# EasyEDA Pro project 数字电子钟（原理图与PCB）.eprj

# Schematic Schematic1
Board Name: Board1; Create Date: 2026-03-15; Page Name: P1; Project Name: 数字电子钟（原理图与PCB）; Schematic Name: Schematic1; Update Date: 2026-03-15; Company: 嘉立创EDA; Page Size: A4; Version: V1.0
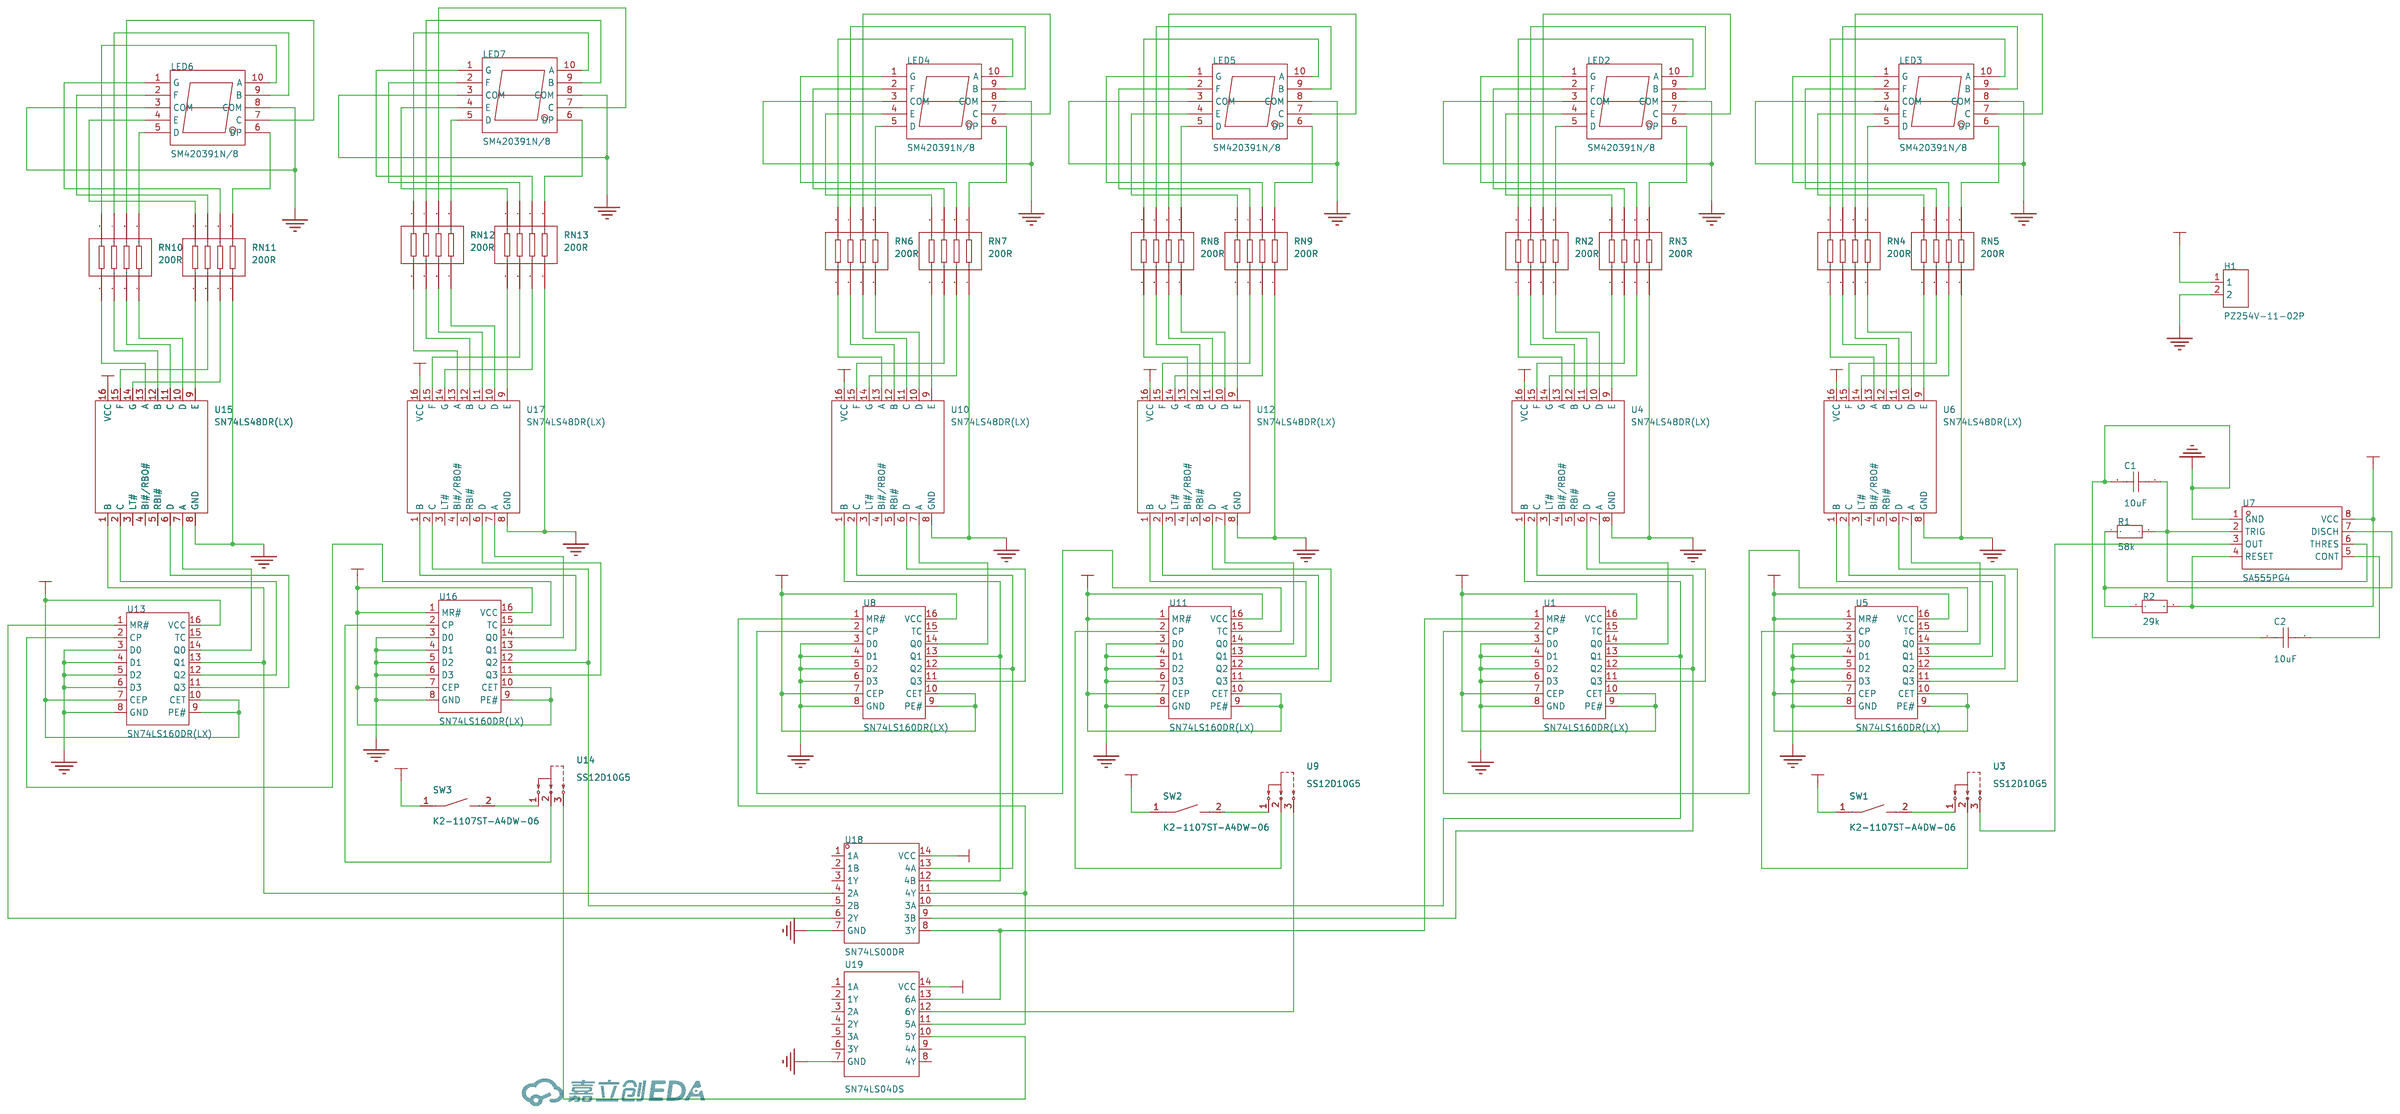
[diagram p0: schematic sheet]

## Parts
C1  10uF  [C0603]
C2  10uF  [C0603]
H1  PZ254V-11-02P  [HDR-TH_2P-P2.54-V-M]
LED2  SM420391N/8  [LED-SEG-TH_10P-L10.0-W13.0-P2.54-S7.62-TL]
LED3  SM420391N/8  [LED-SEG-TH_10P-L10.0-W13.0-P2.54-S7.62-TL]
LED4  SM420391N/8  [LED-SEG-TH_10P-L10.0-W13.0-P2.54-S7.62-TL]
LED5  SM420391N/8  [LED-SEG-TH_10P-L10.0-W13.0-P2.54-S7.62-TL]
LED6  SM420391N/8  [LED-SEG-TH_10P-L10.0-W13.0-P2.54-S7.62-TL]
LED7  SM420391N/8  [LED-SEG-TH_10P-L10.0-W13.0-P2.54-S7.62-TL]
R1  58k  [R2512]
R2  29k  [R2512]
RN2  200R  [RES-ARRAY-SMD_0603-8P-L3.2-W1.6-BL]
RN3  200R  [RES-ARRAY-SMD_0603-8P-L3.2-W1.6-BL]
RN4  200R  [RES-ARRAY-SMD_0603-8P-L3.2-W1.6-BL]
RN5  200R  [RES-ARRAY-SMD_0603-8P-L3.2-W1.6-BL]
RN6  200R  [RES-ARRAY-SMD_0603-8P-L3.2-W1.6-BL]
RN7  200R  [RES-ARRAY-SMD_0603-8P-L3.2-W1.6-BL]
RN8  200R  [RES-ARRAY-SMD_0603-8P-L3.2-W1.6-BL]
RN9  200R  [RES-ARRAY-SMD_0603-8P-L3.2-W1.6-BL]
RN10  200R  [RES-ARRAY-SMD_0603-8P-L3.2-W1.6-BL]
RN11  200R  [RES-ARRAY-SMD_0603-8P-L3.2-W1.6-BL]
RN12  200R  [RES-ARRAY-SMD_0603-8P-L3.2-W1.6-BL]
RN13  200R  [RES-ARRAY-SMD_0603-8P-L3.2-W1.6-BL]
SW1  K2-1107ST-A4DW-06  [KEY-SMD_L6.2-W3.6-LS8.0_K2-1107ST-A4SW-06]
SW2  K2-1107ST-A4DW-06  [KEY-SMD_L6.2-W3.6-LS8.0_K2-1107ST-A4SW-06]
SW3  K2-1107ST-A4DW-06  [KEY-SMD_L6.2-W3.6-LS8.0_K2-1107ST-A4SW-06]
U1  SN74LS160DR(LX)  [SOP-16_L9.9-W3.9-P1.27-LS6.0-BL]
U3  SS12D10G5  [SW-TH_SHOU-HAN_SS12D10G4]
U4  SN74LS48DR(LX)  [SOIC-16_L9.9-W3.8-P1.27-LS6.0-BL]
U5  SN74LS160DR(LX)  [SOP-16_L9.9-W3.9-P1.27-LS6.0-BL]
U6  SN74LS48DR(LX)  [SOIC-16_L9.9-W3.8-P1.27-LS6.0-BL]
U7  SA555PG4  [PDIP-8_L9.6-W6.4-P2.54-LS7.6-BL]
U8  SN74LS160DR(LX)  [SOP-16_L9.9-W3.9-P1.27-LS6.0-BL]
U9  SS12D10G5  [SW-TH_SHOU-HAN_SS12D10G4]
U10  SN74LS48DR(LX)  [SOIC-16_L9.9-W3.8-P1.27-LS6.0-BL]
U11  SN74LS160DR(LX)  [SOP-16_L9.9-W3.9-P1.27-LS6.0-BL]
U12  SN74LS48DR(LX)  [SOIC-16_L9.9-W3.8-P1.27-LS6.0-BL]
U13  SN74LS160DR(LX)  [SOP-16_L9.9-W3.9-P1.27-LS6.0-BL]
U14  SS12D10G5  [SW-TH_SHOU-HAN_SS12D10G4]
U15  SN74LS48DR(LX)  [SOIC-16_L9.9-W3.8-P1.27-LS6.0-BL]
U16  SN74LS160DR(LX)  [SOP-16_L9.9-W3.9-P1.27-LS6.0-BL]
U17  SN74LS48DR(LX)  [SOIC-16_L9.9-W3.8-P1.27-LS6.0-BL]
U18  SN74LS00DR  [SOIC-14_L8.7-W3.9-P1.27-LS6.0-BL]
U19  SN74LS04DS  [SOP-14_L8.6-W3.9-P1.27-LS6.0-BL]

## Library data of the parts
C1 C2 = CGA0603X7R104K500JT: LCSC Part Name: 100nF ±10% 50V; Supplier Part: C6119867; Manufacturer: HRE(芯声); Supplier Footprint: 0603; JLCPCB Part Class: 扩展库; Datasheet: https://item.szlcsc.com/datasheet/CGA0603X7R104K500JT/7062573.html; Supplier: LCSC; Tolerance: ±10%; Voltage Rating: 50V; Temperature Coefficient: X7R
H1 = PZ254V-11-02P: LCSC Part Name: 1x2P 间距:2.54mm 方针 直插; Supplier Part: C492401; Manufacturer: XFCN(兴飞); Supplier Footprint: 插件,P=2.54mm; JLCPCB Part Class: 扩展库; Datasheet: https://item.szlcsc.com/datasheet/PZ254V-11-02P/502957.html; Supplier: LCSC; Pin Structure: 1x2P; Pitch: 2.54mm; Circluar Pins/Square Pins: 方针; Mounting Type: 直插; Number of Rows: 单排; Number of Pins: 2P; Current Rating: 3A; Voltage Rating (Max): 250V; Length of Mating Pin: 6mm; Insulation Height: 2.5mm; Length of End Connection Pin: 3mm; Contact Material: 黄铜; Operating Temperature: -40℃~+105℃; Color: 黑色
LED2-LED7 = SM420391N/8: LCSC Part Name: 1位0.39英寸红色数码管 共阴极; Supplier Part: C252199; Manufacturer: ARKLED(方舟); Supplier Footprint: 插件; JLCPCB Part Class: 扩展库; Datasheet: https://item.szlcsc.com/datasheet/SM420391N%252F8/247672.html; Supplier: LCSC; Number of Characters: 1位; Digit/Alpha Size(inch): 0.39; Illumination Color: 红色; LED Polarity: 共阴极
R1 R2 = JER2512F3R005: LCSC Part Name: 5mΩ 3W 2512 ±1%; Supplier Part: C46634460; Manufacturer: JIERR(捷而瑞); Supplier Footprint: 2512; JLCPCB Part Class: 扩展库; Datasheet: https://item.szlcsc.com/datasheet/JER2512F3R005/48788262.html; Supplier: LCSC; Type: 采样电阻；合金电阻; Tolerance: ±1%; Power(Watts): 3W; Temperature Coefficient: ±50ppm/℃
RN2-RN13 = 4D03WGJ0103T5E: LCSC Part Name: 10kΩ ±5%; Supplier Part: C29718; Manufacturer: UNI-ROYAL(厚声); Supplier Footprint: 0603x4; JLCPCB Part Class: 基础库; Datasheet: https://atta.szlcsc.com/upload/public/pdf/source/20191224/C474318_2527498AE30E813171187CCD28401A71.pdf; Supplier: LCSC; Number of Resistors: 4; Tolerance: ±5%; Power(Watts): 62.5mW; Temperature Coefficient: ±200ppm/℃; Number of Pins: 8
SW1-SW3 = K2-1107ST-A4DW-06: LCSC Part Name: 轻触开关 3.6*6.1*2.5; Supplier Part: C118141; Manufacturer: 韩国韩荣; Supplier Footprint: SMD,6.1x3.6mm; JLCPCB Part Class: 扩展库; Datasheet: https://item.szlcsc.com/datasheet/K2-1107ST-A4DW-06/119400.html; Supplier: LCSC; Circuit: 单刀单掷; Actuator Style: 矩形按钮; Operating Force: 2.5N; Mounting Type: 立贴; Length: 6.1mm; Width: 3.6mm; Switch Height: 2.5mm; Contact Current: 50mA; Voltage Rating: 12V; Life: 10万次; Operating Temperature: -25℃~+85℃
U1 U5 U8 U11 U13 U16 = SN74LS160DR(LX): Supplier Part: C22449619; Manufacturer: LX(灵星芯微); Supplier Footprint: SOP-16; JLCPCB Part Class: Extended Part; Datasheet: https://item.szlcsc.com/datasheet/SN74LS160DR(LX)/24113596.html; Supplier: LCSC; Logic Type: 10分频; Direction: 向上计数器; Voltage - Supply: 2V~6V; Trigger Type: 上升沿; Reset: 异步; Timing: 同步; Count Rate: 35MHz; Operating Temperature: -40℃~+125℃; Number of Bits per Element: 4; Propagation Delay: 19ns
U3 U9 U14 = SS12D10G5: LCSC Part Name: SS12D10G5-7.0; Supplier Part: C7431054; Manufacturer: SHOU HAN(首韩); Supplier Footprint: 插件,12.7x6.7mm; JLCPCB Part Class: 扩展库; Datasheet: https://item.szlcsc.com/datasheet/SS12D10G5/8431406.html; Supplier: LCSC; Circuit: 单刀双掷; Length: 12.7mm; Width: 6.7mm; Mounting Type: 直插; Current Rating: 2A; Voltage Rating: 125V; Life: 3千次; Operating Temperature: -25℃~+70℃
U4 U6 U10 U12 U15 U17 = SN74LS48DR(LX): LCSC Part Name: SN74LS48DR; Supplier Part: C22466305; Manufacturer: LX(灵星芯微); Supplier Footprint: SOP-16; JLCPCB Part Class: Extended Part; Datasheet: https://item.szlcsc.com/datasheet/SN74LS48DR(LX)/24165315.html; Supplier: LCSC; Configuration: 7段x1位; Voltage - Supply: 2V~6V; Features: 共阴极; Operating Temperature: -40℃~+125℃; Pd - Power Dissipation: 500mW
U7 = SA555PG4: Supplier Part: C1539978; Manufacturer: TI(德州仪器); Supplier Footprint: PDIP-8; JLCPCB Part Class: 扩展库; Supplier: LCSC; Supply Voltage: 4.5V~16V; Supply Current: 10mA; Operating Temperature: -40℃~+85℃
U18 = SN74LS00DR: LCSC Part Name: 四路 2 输入正与非门; Supplier Part: C74558; Manufacturer: TI(德州仪器); Supplier Footprint: SOIC-14; JLCPCB Part Class: Extended Part; Datasheet: https://www.ti.com/cn/lit/gpn/sn74ls00; Supplier: LCSC; Logic Type: 与非门; Number of Channels: 4; Voltage - Supply: 4.75V~5.25V; Current - Output Low(IOL): 8mA; Current - Output High(IOH): 400uA; Input Logic Level - High: 2V; Input Logic Level - Low: 800mV; Output Logic Level - High: 2.5V; Output Logic Level - Low: 500mV; Series: 74LS系列; Propagation Delay: 15ns@5V,15pF; Operating Temperature: 0℃~+70℃; Input Number: 2
U19 = SN74LS04DS: Supplier Part: C52091994; Manufacturer: GMIC(绿微); Supplier Footprint: SOP-14; JLCPCB Part Class: Extended Part; Datasheet: https://item.szlcsc.com/datasheet/SN74LS04DS/54863988.html; Supplier: LCSC; Voltage - Supply: 2V~6V; Quiescent Current(Iq): 2uA; Number of Circuits: 6; Current - Output Low(IOL): 5.2mA; Current - Output High(IOH): 5.2mA; Input Logic Level - High: 1.5V~4.2V; Input Logic Level -Low: 500mV~1.8V; Output Logic Level - High: 1.9V~5.9V; Output Logic Level - Low: 100mV~260mV; Propagation Delay: 14ns@6V; Series: 74LS系列; Operating Temperature: -40℃~+125℃

## Nets
+5V: H1.1 R2.2 SW1.1 SW2.1 SW3.1 U1.7(CEP) U1.9(PE#) U1.10(CET) U1.16(VCC) U4.16(VCC) U5.1(MR#) U5.7(CEP) U5.9(PE#) U5.10(CET) U5.16(VCC) U6.16(VCC) U7.4(RESET) U7.8(VCC) U8.7(CEP) U8.9(PE#) U8.10(CET) U8.16(VCC) U10.16(VCC) U11.1(MR#) U11.7(CEP) U11.9(PE#) U11.10(CET) U11.16(VCC) U12.16(VCC) U13.7(CEP) U13.9(PE#) U13.10(CET) U13.16(VCC) U15.16(VCC) U16.1(MR#) U16.7(CEP) U16.9(PE#) U16.10(CET) U16.16(VCC) U17.16(VCC) U18.14(VCC) U19.14(VCC)
GND: C1.2 C2.1 H1.2 LED2.3(COM) LED2.8(COM) LED3.3(COM) LED3.8(COM) LED4.3(COM) LED4.8(COM) LED5.3(COM) LED5.8(COM) LED6.3(COM) LED6.8(COM) LED7.3(COM) LED7.8(COM) RN3.4 RN5.4 RN7.4 RN9.4 RN11.4 RN13.4 U1.3(D0) U1.4(D1) U1.5(D2) U1.6(D3) U1.8(GND) U4.8(GND) U5.3(D0) U5.4(D1) U5.5(D2) U5.6(D3) U5.8(GND) U6.8(GND) U7.1(GND) U8.3(D0) U8.4(D1) U8.5(D2) U8.6(D3) U8.8(GND) U10.8(GND) U11.3(D0) U11.4(D1) U11.5(D2) U11.6(D3) U11.8(GND) U12.8(GND) U13.3(D0) U13.4(D1) U13.5(D2) U13.6(D3) U13.8(GND) U15.8(GND) U16.3(D0) U16.4(D1) U16.5(D2) U16.6(D3) U16.8(GND) U17.8(GND) U18.7(GND) U19.7(GND)
$1N958: U1.13(Q1) U4.1(B) U18.10(3A)
$1N987: U1.14(Q0) U4.7(A)
$1N1052: U1.12(Q2) U4.2(C) U18.9(3B)
$1N1059: U1.11(Q3) U4.6(D)
$1N1738: RN2.1 U4.13(A)
$1N1744: RN2.2 U4.12(B)
$1N1751: RN2.3 U4.11(C)
$1N1758: RN2.4 U4.10(D)
$1N1765: RN3.1 U4.9(E)
$1N1772: RN3.2 U4.15(F)
$1N1781: RN3.3 U4.14(G)
$1N2117: LED2.10(A) RN2.8
$1N2128: LED2.9(B) RN2.7
$1N2138: LED2.7(C) RN2.6
$1N2150: LED2.5(D) RN2.5
$1N2410: LED2.4(E) RN3.8
$1N2417: LED2.2(F) RN3.7
$1N2425: LED2.1(G) RN3.6
$1N2437: LED2.6(DP) RN3.5
$1N2889: U5.13(Q1) U6.1(B)
$1N2894: U5.14(Q0) U6.7(A)
$1N2912: U5.12(Q2) U6.2(C)
$1N2917: U5.11(Q3) U6.6(D)
$1N2922: RN4.1 U6.13(A)
$1N2926: RN4.2 U6.12(B)
$1N2930: RN4.3 U6.11(C)
$1N2934: RN4.4 U6.10(D)
$1N2938: RN5.1 U6.9(E)
$1N2940: RN5.2 U6.15(F)
$1N2944: RN5.3 U6.14(G)
$1N2950: LED3.10(A) RN4.8
$1N2955: LED3.5(D) RN4.5
$1N2958: LED3.7(C) RN4.6
$1N2963: LED3.9(B) RN4.7
$1N2968: LED3.4(E) RN5.8
$1N2973: LED3.2(F) RN5.7
$1N2978: LED3.1(G) RN5.6
$1N2983: LED3.6(DP) RN5.5
$1N3417: R1.1 R2.1 U7.7(DISCH)
$1N3437: C1.1 R1.2 U7.2(TRIG) U7.6(THRES)
$1N3494: C2.2 U7.5(CONT)
$1N3520: U3.3 U7.3(OUT)
$1N3527: U3.2 U5.2(CP)
$1N3641: SW1.2 U3.1
$1N3646: U1.2(CP) U5.15(TC)
$1N4551: U8.13(Q1) U10.1(B) U18.12(4B)
$1N4556: U8.14(Q0) U10.7(A)
$1N4574: U8.12(Q2) U10.2(C) U18.13(4A)
$1N4579: U8.11(Q3) U10.6(D)
$1N4584: RN6.1 U10.13(A)
$1N4588: RN6.2 U10.12(B)
$1N4592: RN6.3 U10.11(C)
$1N4596: RN6.4 U10.10(D)
$1N4600: RN7.1 U10.9(E)
$1N4602: RN7.2 U10.15(F)
$1N4606: RN7.3 U10.14(G)
$1N4612: LED4.10(A) RN6.8
$1N4617: LED4.5(D) RN6.5
$1N4620: LED4.7(C) RN6.6
$1N4625: LED4.9(B) RN6.7
$1N4630: LED4.4(E) RN7.8
$1N4635: LED4.2(F) RN7.7
$1N4640: LED4.1(G) RN7.6
$1N4645: LED4.6(DP) RN7.5
$1N4671: U11.13(Q1) U12.1(B)
$1N4676: U11.14(Q0) U12.7(A)
$1N4694: U11.12(Q2) U12.2(C)
$1N4699: U11.11(Q3) U12.6(D)
$1N4704: RN8.1 U12.13(A)
$1N4708: RN8.2 U12.12(B)
$1N4712: RN8.3 U12.11(C)
$1N4716: RN8.4 U12.10(D)
$1N4720: RN9.1 U12.9(E)
$1N4722: RN9.2 U12.15(F)
$1N4726: RN9.3 U12.14(G)
$1N4732: LED5.10(A) RN8.8
$1N4737: LED5.5(D) RN8.5
$1N4740: LED5.7(C) RN8.6
$1N4745: LED5.9(B) RN8.7
$1N4750: LED5.4(E) RN9.8
$1N4755: LED5.2(F) RN9.7
$1N4760: LED5.1(G) RN9.6
$1N4765: LED5.6(DP) RN9.5
$1N4784: U9.2 U11.2(CP)
$1N4792: SW2.2 U9.1
$1N4794: U8.2(CP) U11.15(TC)
$1N5692: U13.14(Q0) U15.7(A)
$1N5710: U13.12(Q2) U15.2(C)
$1N5715: U13.11(Q3) U15.6(D)
$1N5720: RN10.1 U15.13(A)
$1N5724: RN10.2 U15.12(B)
$1N5728: RN10.3 U15.11(C)
$1N5732: RN10.4 U15.10(D)
$1N5736: RN11.1 U15.9(E)
$1N5738: RN11.2 U15.15(F)
$1N5742: RN11.3 U15.14(G)
$1N5748: LED6.10(A) RN10.8
$1N5753: LED6.5(D) RN10.5
$1N5756: LED6.7(C) RN10.6
$1N5761: LED6.9(B) RN10.7
$1N5766: LED6.4(E) RN11.8
$1N5771: LED6.2(F) RN11.7
$1N5776: LED6.1(G) RN11.6
$1N5781: LED6.6(DP) RN11.5
$1N5807: U16.13(Q1) U17.1(B)
$1N5812: U16.14(Q0) U17.7(A)
$1N5830: U16.12(Q2) U17.2(C) U18.5(2B)
$1N5835: U16.11(Q3) U17.6(D)
$1N5840: RN12.1 U17.13(A)
$1N5844: RN12.2 U17.12(B)
$1N5848: RN12.3 U17.11(C)
$1N5852: RN12.4 U17.10(D)
$1N5856: RN13.1 U17.9(E)
$1N5858: RN13.2 U17.15(F)
$1N5862: RN13.3 U17.14(G)
$1N5868: LED7.10(A) RN12.8
$1N5873: LED7.5(D) RN12.5
$1N5876: LED7.7(C) RN12.6
$1N5881: LED7.9(B) RN12.7
$1N5886: LED7.4(E) RN13.8
$1N5891: LED7.2(F) RN13.7
$1N5896: LED7.1(G) RN13.6
$1N5901: LED7.6(DP) RN13.5
$1N5916: U14.2 U16.2(CP)
$1N5924: SW3.2 U14.1
$1N5926: U13.2(CP) U16.15(TC)
$1N6192: U8.1(MR#) U18.11(4Y) U19.11(5A)
$1N6278: U1.1(MR#) U18.8(3Y) U19.13(6A)
$1N6512: U9.3 U19.12(6Y)
$1N6532: U14.3 U19.10(5Y)
$1N6571: U13.1(MR#) U18.6(2Y)
$1N6582: U13.13(Q1) U15.1(B) U18.4(2A)

Not connected (* = marked no-connect by the designer): U1 15(TC); U4 3(LT#) 4(BI#/RBO#) 5(RBI#); U6 3(LT#) 4(BI#/RBO#) 5(RBI#); U8 15(TC); U10 3(LT#) 4(BI#/RBO#) 5(RBI#); U12 3(LT#) 4(BI#/RBO#) 5(RBI#); U13 15(TC); U15 3(LT#) 4(BI#/RBO#) 5(RBI#); U17 3(LT#) 4(BI#/RBO#) 5(RBI#); U18 1(1A) 2(1B) 3(1Y); U19 1(1A) 2(1Y) 3(2A) 4(2Y) 5(3A) 6(3Y) 8(4Y) 9(4A)

# Board PCB1
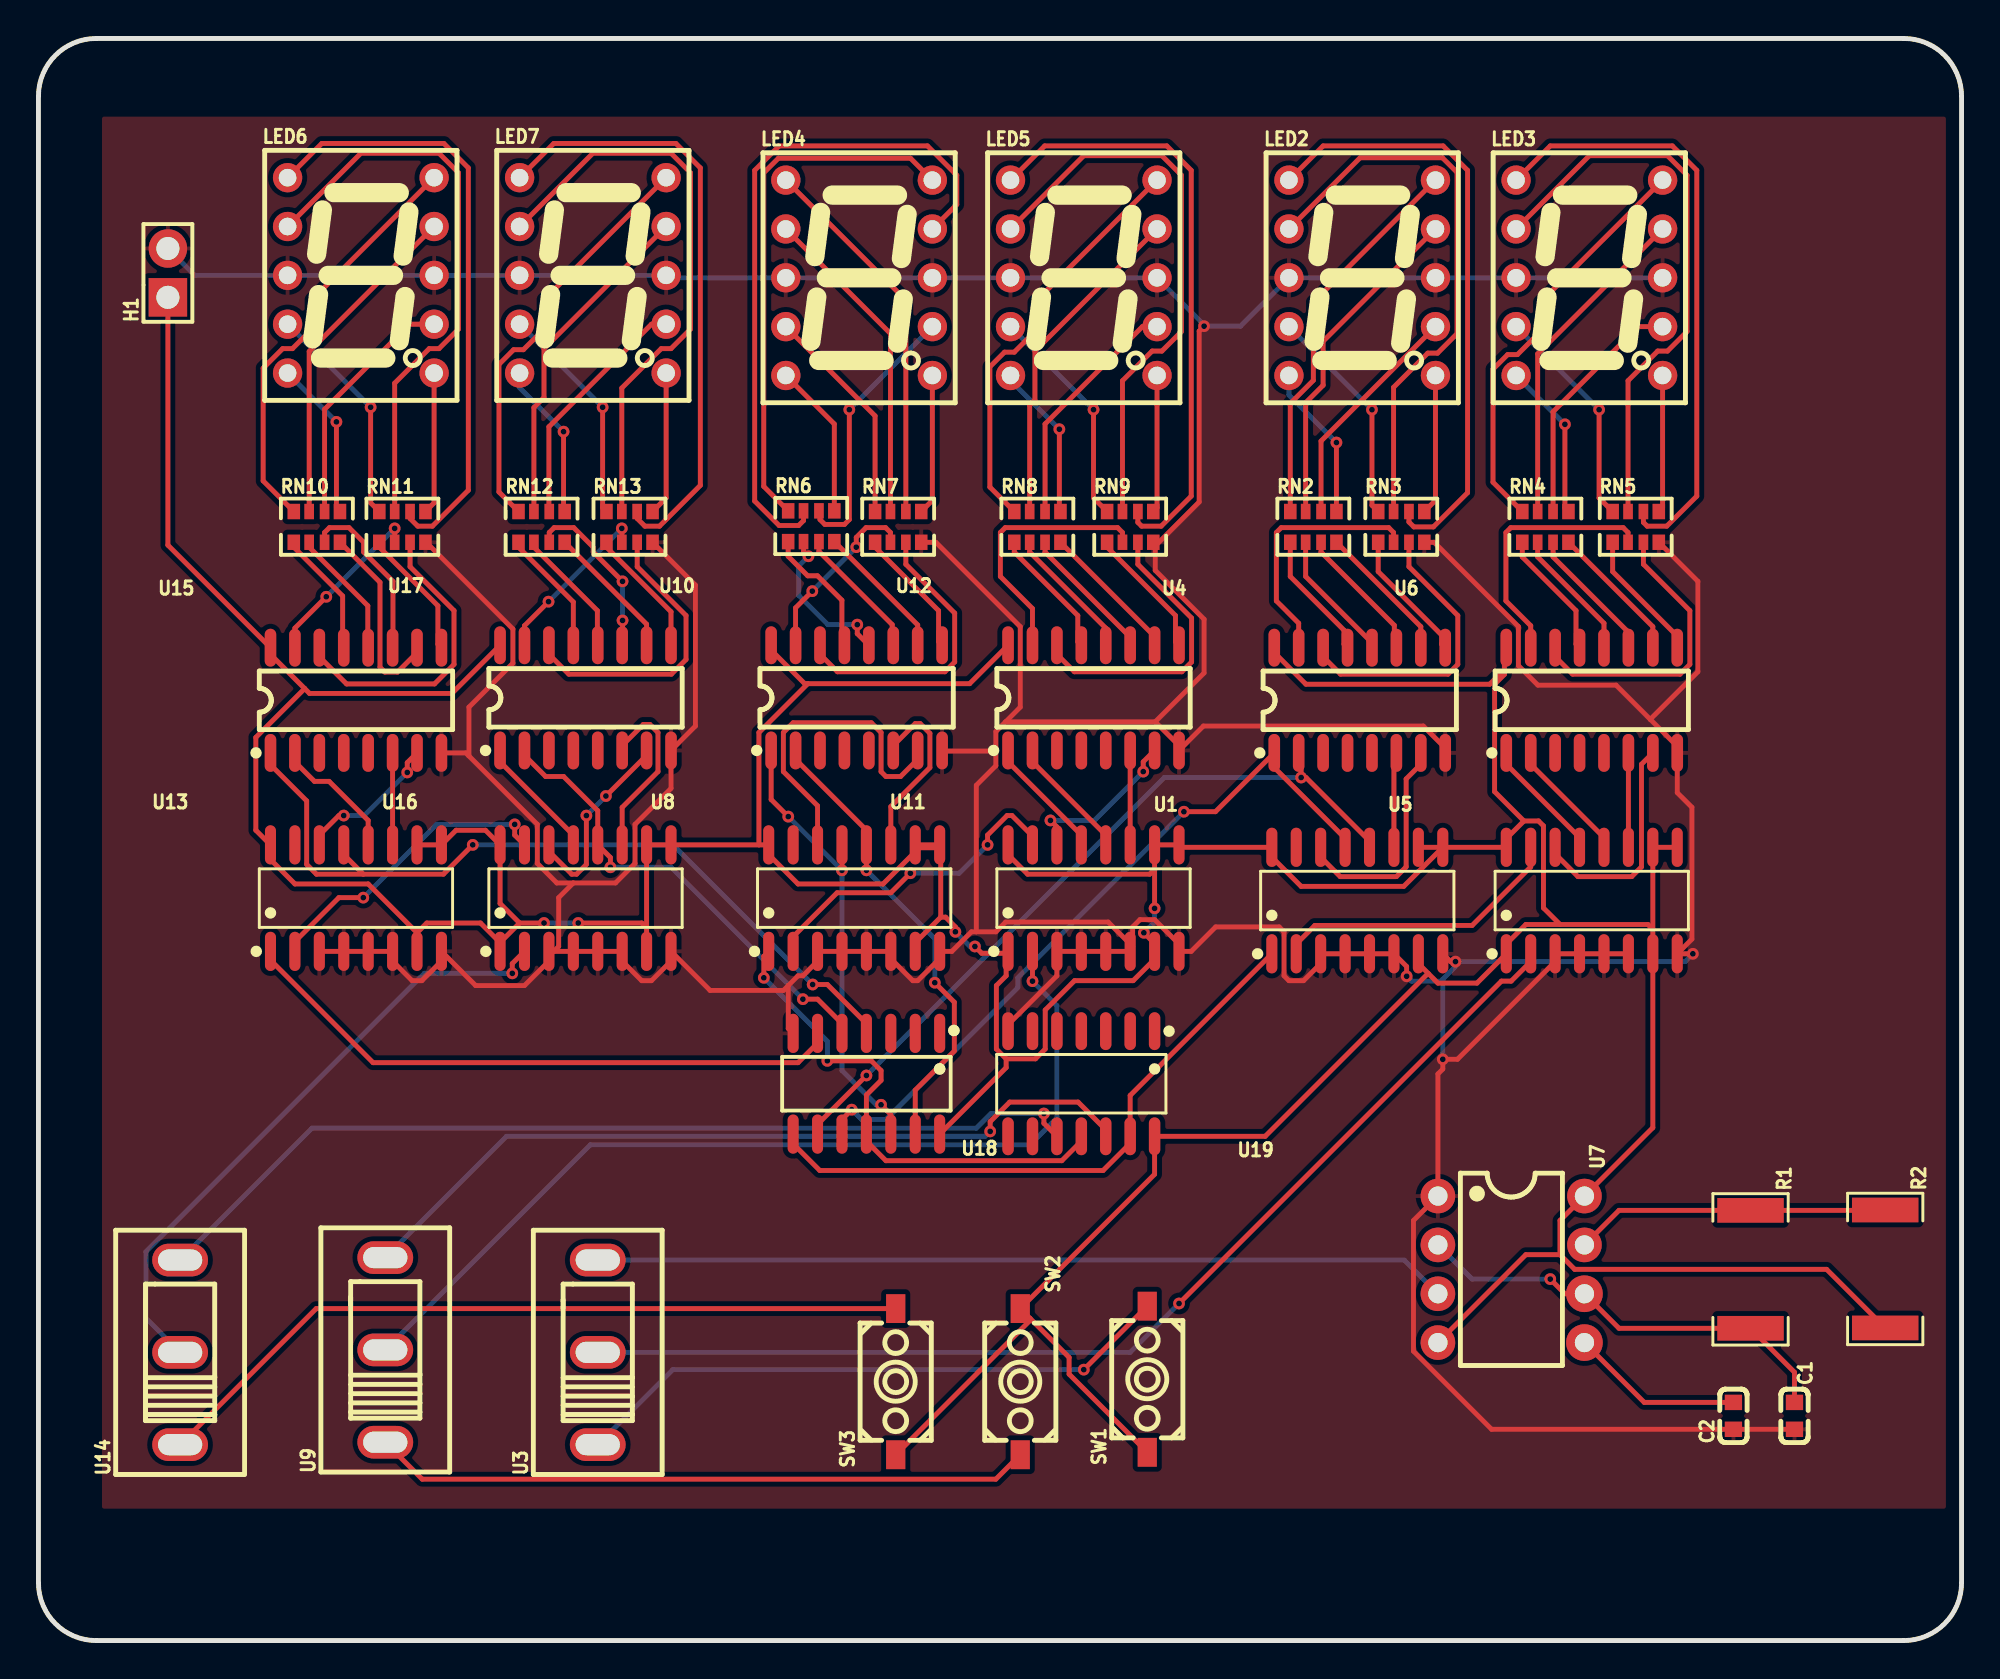
[diagram p1: board, top side]
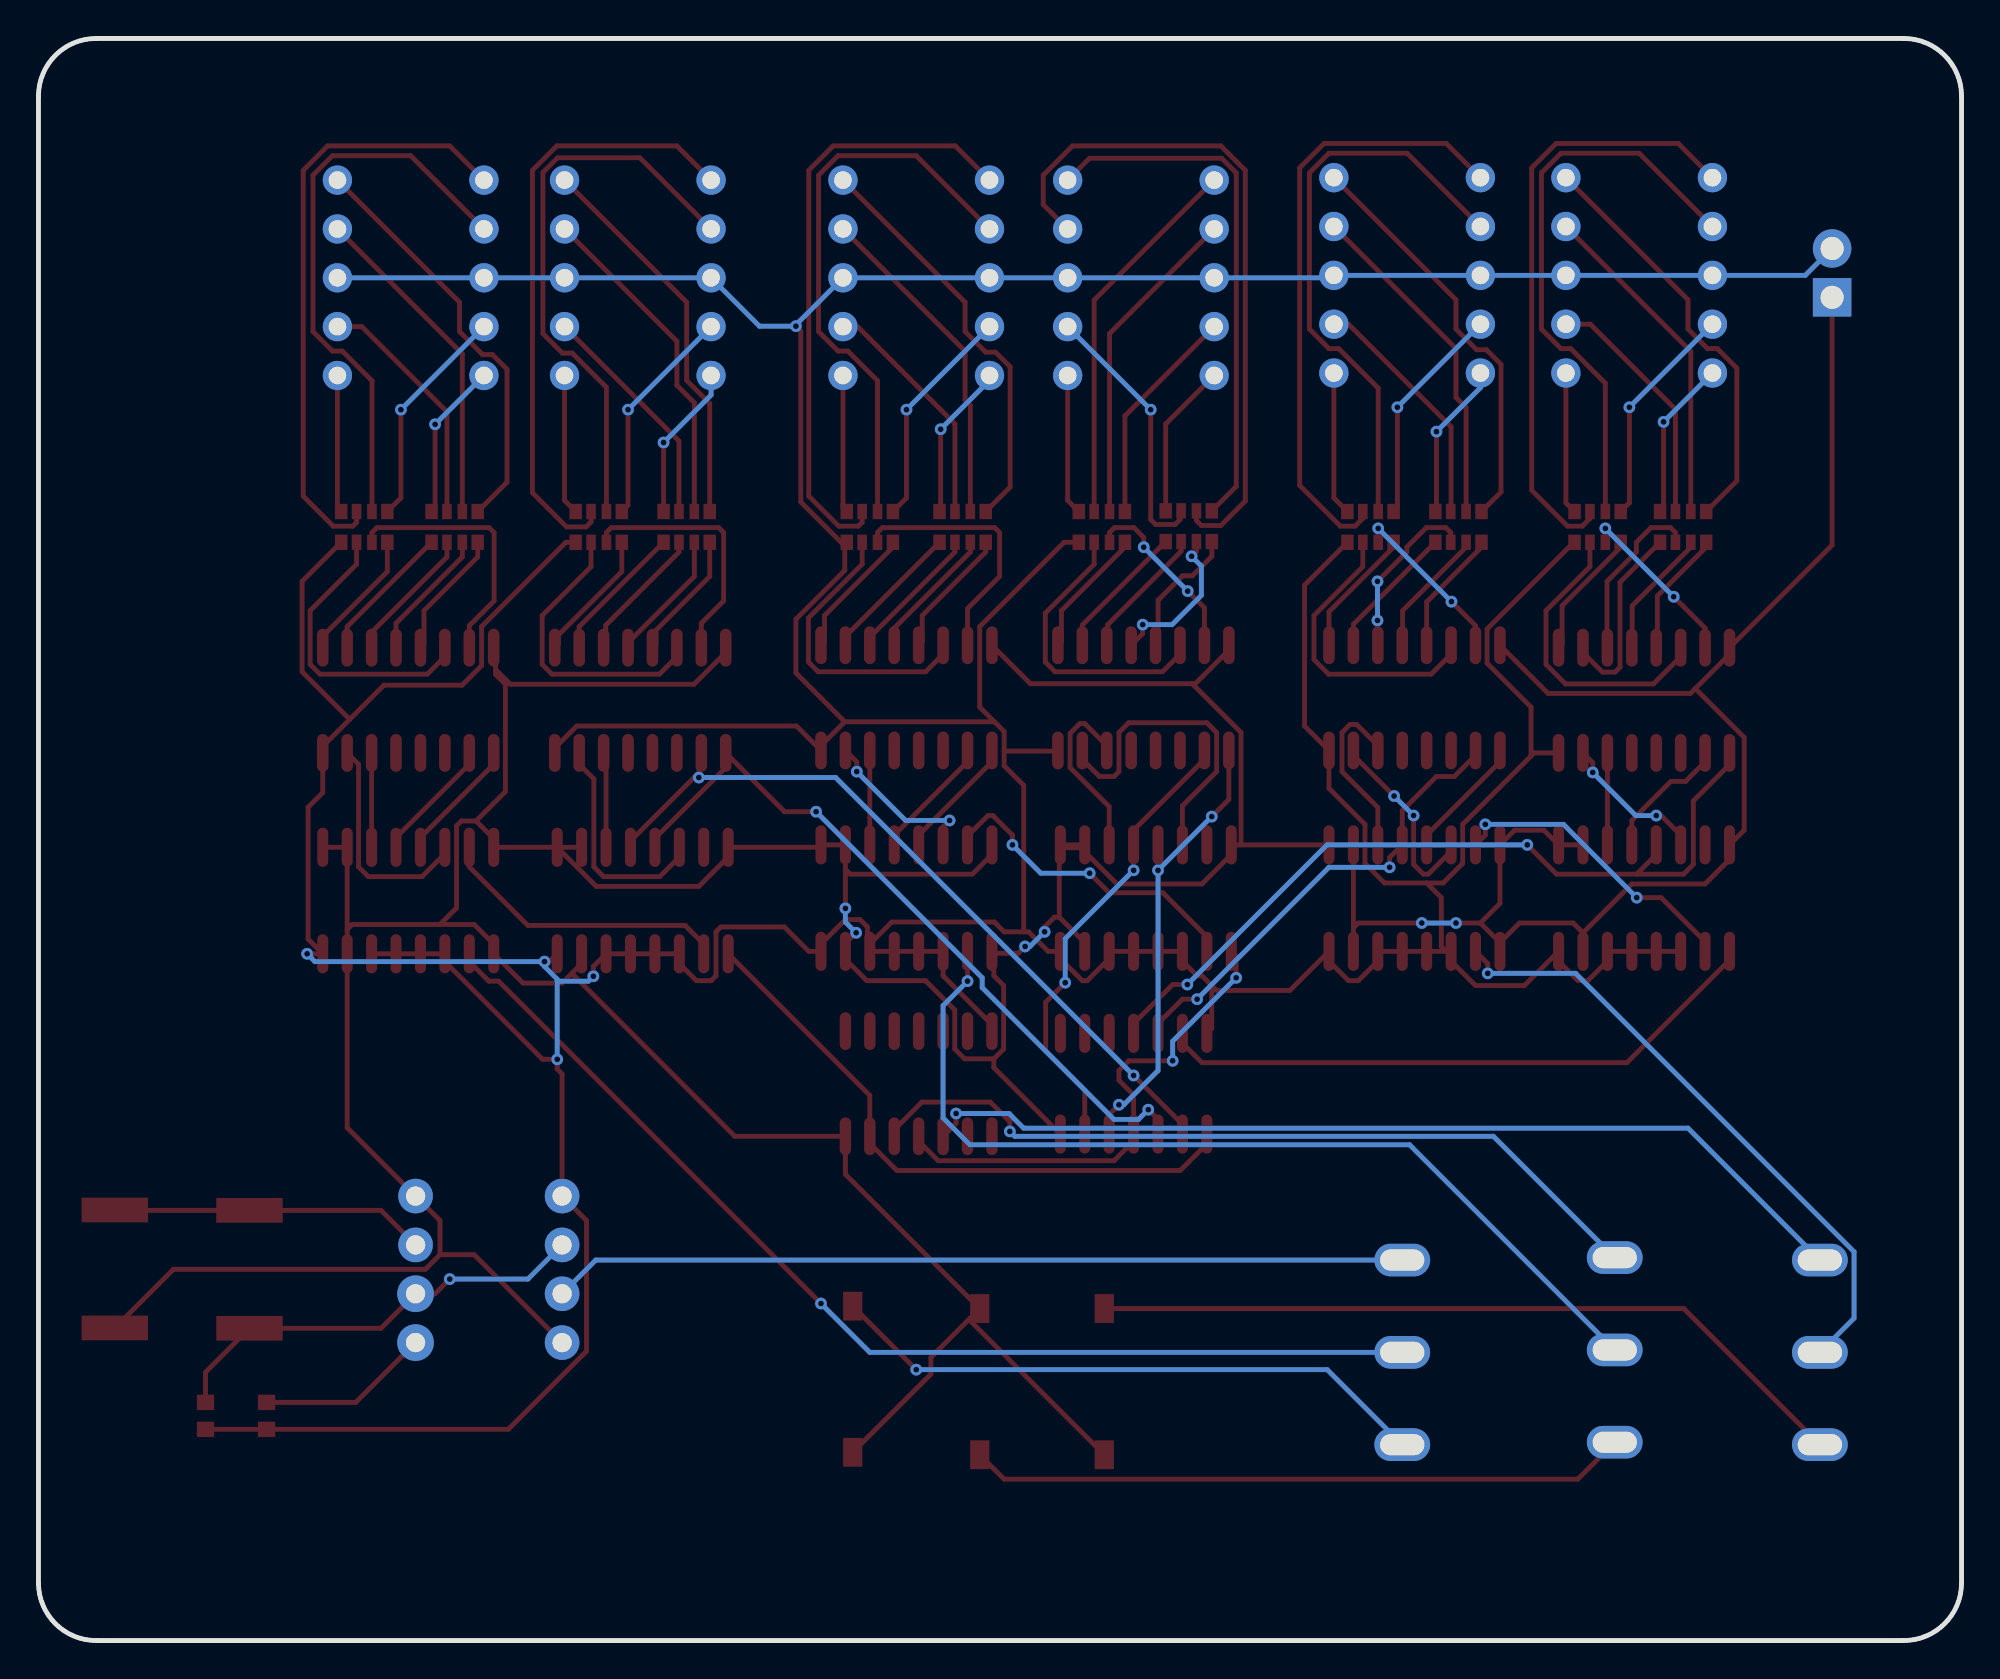
[diagram p2: board, bottom side, seen from below]

Outline 100 x 83.31 mm; copper layers: Top Layer, Bottom Layer. Coordinates in mm from the lower left corner of the outline.
Outline path: 0,80.31 0,3 arc(0.88,0.88) 3,0 97,0 arc(99.12,0.88) 100,3 100,80.31 arc(99.12,82.43) 97,83.31 3,83.31 arc(0.88,82.43) 0,80.31
Stack: Top Layer 0.035mm / Dielectric1 1.51mm FR4 er 4.5 / Bottom Layer 0.035mm

## Design rules (mm)
template: JLCPCB Capability(Two Layers Board)
spacing copperThickness1oz (default): track to track 0.102, other pairs 0.152 to 0.3
spacing copperThickness2oz: track to track 0.203, other pairs 0.152 to 0.3
track width copperThickness1oz (default): min 0.127, default 0.254, max 2.54
track width copperThickness2oz: min 0.203, default 0.254, max 2.54
differential pair differentialPair (default): width min 0.127, default 0.254, max 2.54; gap min 0.152, default 0.152
via viaSize (default): diameter min 0.5, default 0.61, max 10; hole min 0.3, default 0.305, max 6.3

## Placement (name value [footprint] x y rotation side)
C1  10uF  [C0603]  91.31 11.68 270 top
C2  10uF  [C0603]  88.14 11.68 90 top
H1  PZ254V-11-02P  [HDR-TH_2P-P2.54-V-M]  6.73 71.12 90 top
LED2  SM420391N/8  [LED-SEG-TH_10P-L10.0-W13.0-P2.54-S7.62-TL]  68.83 70.87 0 top
LED3  SM420391N/8  [LED-SEG-TH_10P-L10.0-W13.0-P2.54-S7.62-TL]  80.65 70.87 0 top
LED4  SM420391N/8  [LED-SEG-TH_10P-L10.0-W13.0-P2.54-S7.62-TL]  42.67 70.87 0 top
LED5  SM420391N/8  [LED-SEG-TH_10P-L10.0-W13.0-P2.54-S7.62-TL]  54.36 70.87 0 top
LED6  SM420391N/8  [LED-SEG-TH_10P-L10.0-W13.0-P2.54-S7.62-TL]  16.76 70.99 0 top
LED7  SM420391N/8  [LED-SEG-TH_10P-L10.0-W13.0-P2.54-S7.62-TL]  28.83 70.99 0 top
R1  58k  [R2512]  89.03 19.3 270 top
R2  29k  [R2512]  96.03 19.32 270 top
RN2  200R  [RES-ARRAY-SMD_0603-8P-L3.2-W1.6-BL]  66.29 57.91 0 top
RN3  200R  [RES-ARRAY-SMD_0603-8P-L3.2-W1.6-BL]  70.87 57.91 0 top
RN4  200R  [RES-ARRAY-SMD_0603-8P-L3.2-W1.6-BL]  78.36 57.91 0 top
RN5  200R  [RES-ARRAY-SMD_0603-8P-L3.2-W1.6-BL]  83.06 57.91 0 top
RN6  200R  [RES-ARRAY-SMD_0603-8P-L3.2-W1.6-BL]  40.18 57.95 0 top
RN7  200R  [RES-ARRAY-SMD_0603-8P-L3.2-W1.6-BL]  44.7 57.91 0 top
RN8  200R  [RES-ARRAY-SMD_0603-8P-L3.2-W1.6-BL]  51.94 57.91 0 top
RN9  200R  [RES-ARRAY-SMD_0603-8P-L3.2-W1.6-BL]  56.77 57.91 0 top
RN10  200R  [RES-ARRAY-SMD_0603-8P-L3.2-W1.6-BL]  14.48 57.91 0 top
RN11  200R  [RES-ARRAY-SMD_0603-8P-L3.2-W1.6-BL]  18.92 57.91 0 top
RN12  200R  [RES-ARRAY-SMD_0603-8P-L3.2-W1.6-BL]  26.16 57.91 0 top
RN13  200R  [RES-ARRAY-SMD_0603-8P-L3.2-W1.6-BL]  30.73 57.91 0 top
SW1  K2-1107ST-A4DW-06  [KEY-SMD_L6.2-W3.6-LS8.0_K2-1107ST-A4SW-06]  57.66 13.59 90 top
SW2  K2-1107ST-A4DW-06  [KEY-SMD_L6.2-W3.6-LS8.0_K2-1107ST-A4SW-06]  51.05 13.46 270 top
SW3  K2-1107ST-A4DW-06  [KEY-SMD_L6.2-W3.6-LS8.0_K2-1107ST-A4SW-06]  44.58 13.46 90 top
U1  SN74LS160DR(LX)  [SOP-16_L9.9-W3.9-P1.27-LS6.0-BL]  68.58 38.48 0 top
U3  SS12D10G5  [SW-TH_SHOU-HAN_SS12D10G4]  29.08 14.99 90 top
U4  SN74LS48DR(LX)  [SOIC-16_L9.9-W3.8-P1.27-LS6.0-BL]  68.71 48.89 0 top
U5  SN74LS160DR(LX)  [SOP-16_L9.9-W3.9-P1.27-LS6.0-BL]  80.77 38.48 0 top
U6  SN74LS48DR(LX)  [SOIC-16_L9.9-W3.8-P1.27-LS6.0-BL]  80.77 48.89 0 top
U7  SA555PG4  [PDIP-8_L9.6-W6.4-P2.54-LS7.6-BL]  76.58 19.3 270 top
U8  SN74LS160DR(LX)  [SOP-16_L9.9-W3.9-P1.27-LS6.0-BL]  42.42 38.61 0 top
U9  SS12D10G5  [SW-TH_SHOU-HAN_SS12D10G4]  18.03 15.11 90 top
U10  SN74LS48DR(LX)  [SOIC-16_L9.9-W3.8-P1.27-LS6.0-BL]  42.54 49.02 0 top
U11  SN74LS160DR(LX)  [SOP-16_L9.9-W3.9-P1.27-LS6.0-BL]  54.86 38.61 0 top
U12  SN74LS48DR(LX)  [SOIC-16_L9.9-W3.8-P1.27-LS6.0-BL]  54.86 49.02 0 top
U13  SN74LS160DR(LX)  [SOP-16_L9.9-W3.9-P1.27-LS6.0-BL]  16.51 38.61 0 top
U14  SS12D10G5  [SW-TH_SHOU-HAN_SS12D10G4]  7.37 14.99 90 top
U15  SN74LS48DR(LX)  [SOIC-16_L9.9-W3.8-P1.27-LS6.0-BL]  16.51 48.89 0 top
U16  SN74LS160DR(LX)  [SOP-16_L9.9-W3.9-P1.27-LS6.0-BL]  28.45 38.61 0 top
U17  SN74LS48DR(LX)  [SOIC-16_L9.9-W3.8-P1.27-LS6.0-BL]  28.45 49.02 0 top
U18  SN74LS00DR  [SOIC-14_L8.7-W3.9-P1.27-LS6.0-BL]  43.05 28.96 180 top
U19  SN74LS04DS  [SOP-14_L8.6-W3.9-P1.27-LS6.0-BL]  54.23 28.96 180 top

## Footprints (pads in the part's own frame, mm; a bottom-side part is the same pattern mirrored in y, then rotated)
C0603
  rect 0.8x0.9 smd: 1(-0.7,0) 2(0.7,0)
HDR-TH_2P-P2.54-V-M
  rect 2x2 hole 1.2: 1(-1.27,0)
  round 2 hole 1.2: 2(1.27,0)
KEY-SMD_L6.2-W3.6-LS8.0_K2-1107ST-A4SW-06
  rect 1.5x1 smd: 1(-3.8,0) 2(3.8,0)
LED-SEG-TH_10P-L10.0-W13.0-P2.54-S7.62-TL
  round 1.524 hole 0.914: 1(-3.81,5.08) 2(-3.81,2.54) 3(-3.81,0) 4(-3.81,-2.54) 5(-3.81,-5.08) 6(3.81,-5.08) 7(3.81,-2.54) 8(3.81,0) 9(3.81,2.54) 10(3.81,5.08)
PDIP-8_L9.6-W6.4-P2.54-LS7.6-BL
  round 1.8 hole 1: 1(-3.81,-3.81) 2(-1.27,-3.81) 3(1.27,-3.81) 4(3.81,-3.81) 7(-1.27,3.81) 8(-3.81,3.81)
  round 1.905 hole 1: 5(3.81,3.81) 6(1.27,3.81)
R2512
  rect 1.282x3.456 smd: 1(-3.067,0) 2(3.067,0)
RES-ARRAY-SMD_0603-8P-L3.2-W1.6-BL
  rect 0.65x0.8 smd: 1(-1.2,-0.8) 4(1.2,-0.8) 5(1.2,0.8) 8(-1.2,0.8)
  rect 0.5x0.8 smd: 2(-0.4,-0.8) 3(0.4,-0.8) 6(0.4,0.8) 7(-0.4,0.8)
SOIC-14_L8.7-W3.9-P1.27-LS6.0-BL
  oval 0.574x2.038 smd: 1(-3.81,-2.619) 2(-2.54,-2.619) 3(-1.27,-2.619) 4(0,-2.619) 5(1.27,-2.619) 6(2.54,-2.619) 7(3.81,-2.619) 8(3.81,2.619) 9(2.54,2.619) 10(1.27,2.619) 11(0,2.619) 12(-1.27,2.619) 13(-2.54,2.619) 14(-3.81,2.619)
SOIC-16_L9.9-W3.8-P1.27-LS6.0-BL
  oval 0.602x1.971 smd: 1(-4.445,-2.736) 2(-3.175,-2.736) 3(-1.905,-2.736) 4(-0.635,-2.736) 5(0.635,-2.736) 6(1.905,-2.736) 7(3.175,-2.736) 8(4.445,-2.736) 9(4.445,2.736) 10(3.175,2.736) 11(1.905,2.736) 12(0.635,2.736) 13(-0.635,2.736) 14(-1.905,2.736) 15(-3.175,2.736) 16(-4.445,2.736)
SOP-14_L8.6-W3.9-P1.27-LS6.0-BL
  oval 0.595x1.968 smd: 1(-3.81,-2.734) 2(-2.54,-2.734) 3(-1.27,-2.734) 4(0,-2.734) 5(1.27,-2.734) 6(2.54,-2.734) 7(3.81,-2.734) 8(3.81,2.734) 9(2.54,2.734) 10(1.27,2.734) 11(0,2.734) 12(-1.27,2.734) 13(-2.54,2.734) 14(-3.81,2.734)
SOP-16_L9.9-W3.9-P1.27-LS6.0-BL
  oval 0.574x2.038 smd: 1(-4.445,-2.769) 2(-3.175,-2.769) 3(-1.905,-2.769) 4(-0.635,-2.769) 5(0.635,-2.769) 6(1.905,-2.769) 7(3.175,-2.769) 8(4.445,-2.769) 9(4.445,2.769) 10(3.175,2.769) 11(1.905,2.769) 12(0.635,2.769) 13(-0.635,2.769) 14(-1.905,2.769) 15(-3.175,2.769) 16(-4.445,2.769)
SW-TH_SHOU-HAN_SS12D10G4
  oval 1.7x2.9 hole 1.1x2.3: 1(-4.8,0) 2(0,0) 3(4.8,0)

## Nets
As in the schematic.

Pads without a net: U1 15; U4 3 4 5; U6 3 4 5; U8 15; U10 3 4 5; U12 3 4 5; U13 15; U15 3 4 5; U17 3 4 5; U18 1 2 3; U19 1 2 3 4 5 6 8 9

## Via types
v1: diameter 0.61, hole 0.305, Top Layer to Bottom Layer, 64 vias

## Routing (per net, layer and track width the routed paths; a pad name or vN(x,y) marks a point on that pad's centre or on a via; arc(x,y) is an arc through that point)
+5V: length 342.3
  Top Layer w0.254: 13.84,49.5 11.3,46.97 11.3,42.14 U13.16 12.06,40.62 13.33,39.34 17.14,39.34 19.69,36.81 ; 13.84,49.5 14.1,49.25 21.5,49.25 U17.16 ; 13.84,49.5 12.06,51.28 U15.16 6.73,56.96 H1.1 ; 79.12,20.07 79.88,19.3 92.98,19.3 R2.2 ; 79.12,20.07 77.34,20.07 U7.4 ; 79.12,20.07 79.12,21.84 U7.8 83.95,26.67 U5.7 83.95,36.98 ; 31.62,37.06 31.37,37.31 v1(28.07,37.31) ; 31.62,37.06 U16.10 U16.9 37.47,41.38 ; 31.62,37.06 U16.7 ; 25.02,37.31 24,36.3 ; 25.02,37.31 24,38.33 U16.16 23.24,42.14 21.72,42.14 U13.9 U13.10 ; 25.02,37.31 v1(26.29,37.31) ; 24,36.3 U16.1 ; 24,36.3 22.99,37.31 20.19,37.31 19.69,36.81 ; U11.16 50.42,40.87 51.44,39.85 57.78,39.85 58.04,40.11 ; 58.04,40.11 v1(58.04,38.08) ; 58.04,40.11 U11.10 U11.9 59.44,41.25 64.13,41.25 64.13,40.74 65.66,39.22 70.99,39.22 73.03,41.25 ; 83.95,36.98 83.69,37.24 79.12,37.24 ; 83.95,36.98 83.95,41.25 85.22,41.25 ; U6.16 76.23,51.53 76.23,50.49 ; 40,49.76 37.47,47.22 37.47,41.38 ; 40,49.76 39.84,49.76 38.23,51.38 38.23,51.63 U10.16 ; 40,49.76 48.42,49.76 U12.16 ; SW1.1 53.59,13.85 53.59,14.72 51.56,16.75 ; 76.23,50.49 76.23,50.24 75.72,49.73 75.72,44.14 77.24,42.62 ; 76.23,50.49 75.47,49.73 65.91,49.73 64.26,51.38 U4.16 ; 77.24,42.62 78.01,42.62 78.26,42.37 78.26,38.1 79.12,37.24 ; 77.24,42.62 76.33,41.7 76.33,41.25 73.03,41.25 ; 73.03,41.25 71.75,41.25 ; 72.26,34.7 63.79,26.22 U19.14 58.04,24.25 SW2.1 51.56,16.75 ; 72.26,34.7 72.77,34.19 74.8,34.19 U5.1 76.33,36.22 77.34,37.24 79.12,37.24 ; 72.26,34.7 71.75,35.2 U1.7 ; 46.86,41.23 U8.9 45.59,41.38 ; 46.86,41.23 46.92,41.17 46.92,37.62 ; 46.86,41.23 45.8,41.23 43.92,39.34 39.5,39.34 37.97,40.87 U8.16 37.47,41.38 ; 19.69,36.81 U13.7 ; 50.32,35.74 50.32,34.57 49.81,34.06 49.81,30.76 50.32,30.25 ; 50.32,35.74 U11.1 ; 50.32,35.74 49.05,35.74 v1(48.7,36.09) ; 46.92,37.62 45.59,36.29 45.59,35.84 ; 46.92,37.62 47.17,37.62 47.68,37.11 v1(47.68,36.86) ; SW3.1 51.56,16.65 51.56,16.75 ; 57.99,35.89 57.99,35.38 56.92,34.31 53.88,34.31 52.35,32.79 52.35,30.76 51.84,30.25 50.32,30.25 ; 57.99,35.89 U11.7 ; 57.99,35.89 57.99,36.3 v1(57.48,36.81) ; 50.32,30.25 50.32,29.79 U18.14
  Bottom Layer w0.254: v1(58.04,38.08) 58.04,37.36 v1(57.48,36.81) ; v1(47.68,36.86) 48.44,36.09 v1(48.7,36.09) ; v1(28.07,37.31) v1(26.29,37.31)
GND: length 405.1
  Top Layer w0.254: U4.8 73.15,46.41 72.01,47.56 60.58,47.56 U12.8 59.31,46.54 58.07,47.78 ; 50.29,47.78 51.05,48.54 51.05,52.72 46.67,57.11 RN7.4 ; 50.29,47.78 49.78,47.27 49.78,46.25 ; 50.29,47.78 58.07,47.78 ; 48.77,36.86 49.78,36.86 50.29,37.36 55.63,37.36 56.9,36.09 ; 48.77,36.86 48.77,44.48 49.78,45.49 49.78,46.25 ; 48.77,36.86 48.51,36.86 47.5,35.84 46.99,35.84 ; U19.7 50.42,32.03 52.96,34.57 U11.3 U11.4 U11.5 U11.6 56.9,35.97 56.9,36.09 ; 26.8,35.84 27.05,36.09 27.05,38.63 27.81,39.39 ; 26.8,35.84 U16.3 26.54,35.33 25.27,34.06 22.73,34.06 U13.8 20.95,35.33 19.94,34.31 19.43,34.31 18.42,35.33 U13.6 U13.4 U13.3 ; 26.8,35.84 U16.4 U16.5 U16.6 30.35,35.33 31.37,34.31 31.88,34.31 32.89,35.33 U16.8 34.93,33.81 38.74,33.81 38.99,34.06 ; U10.8 47.02,46.25 49.78,46.25 ; 58.07,56.92 58.07,57.01 RN9.4 ; 58.07,56.92 60.36,59.21 60.36,68.1 v1(60.61,68.35) ; 58.07,56.92 58.07,55.65 60.61,53.11 60.61,50.32 58.07,47.78 ; 56.9,36.09 56.9,37.11 57.28,37.49 58.04,37.49 59.44,36.09 59.44,35.84 ; v1(73.69,35.31) 73.43,35.31 U1.8 ; 38.99,34.06 39.5,34.57 39.75,34.57 40.51,35.33 U8.3 U8.4 U8.5 U8.6 44.45,35.71 44.45,35.33 45.47,34.31 45.72,34.31 46.99,35.59 46.99,35.84 ; 38.99,34.06 38.99,31.83 U18.7 ; U5.6 U5.4 U5.3 78.87,35.31 73.79,30.23 v1(73.03,30.23) 73.03,29.72 72.77,29.46 U7.1 71.5,21.84 71.5,15.05 75.56,10.98 C2.1 C1.2 ; 27.81,39.39 26.96,39.39 25.94,40.41 25.94,42.44 22.39,46 ; 27.81,39.39 30.01,39.39 31.02,40.41 31.02,42.44 32.89,44.31 U17.8 34.16,47.56 34.16,54.88 RN13.4 ; RN3.4 72.57,57.11 76.96,52.73 76.96,50.7 77.97,49.68 82.04,49.68 83.81,47.9 ; U15.8 22.22,46.16 22.39,46 ; 46.99,35.84 U8.8 ; 22.39,46 22.39,48.54 24.67,50.83 24.67,52.6 20.16,57.11 RN11.4 ; 59.44,35.84 U11.8 ; 59.44,35.84 59.94,35.84 61.21,37.11 64.52,37.11 64.77,36.86 64.77,34.57 65.02,34.31 65.79,34.31 66.68,35.2 U1.3 U1.5 U1.6 71.15,35.05 v1(71.15,34.54) ; 83.81,47.9 86.29,50.38 86.29,55.08 RN5.4 ; 83.81,47.9 85.22,46.5 85.22,44.09 85.98,43.33 85.98,36.47 U5.8 v1(86.03,35.71)
  Bottom Layer w0.254: v1(73.03,30.23) 73.03,34.29 ; 73.03,34.29 71.4,34.29 v1(71.15,34.54) ; 73.03,34.29 73.03,34.39 73.69,35.05 v1(73.69,35.31) 85.62,35.31 v1(86.03,35.71) ; H1.2 8.13,70.99 LED6.3 LED6.8 LED7.3 LED7.8 32.77,70.87 LED4.3 LED4.8 LED5.3 LED5.8 60.61,68.42 v1(60.61,68.35) 62.51,68.35 LED2.3 LED2.8 LED3.3 LED3.8
$1N958: length 38.3
  Top Layer w0.254: U18.10 41.78,27.1 v1(42.29,27.61) ; v1(59.56,43.1) 61.2,43.1 U4.1 64.26,45.4 67.82,41.84 67.82,41.38 67.94,41.25
  Bottom Layer w0.254: v1(42.29,27.61) 42.8,27.1 44.07,27.1 50.93,33.96 50.93,34.47 v1(59.56,43.1)
$1N987: length 11.8
  Top Layer w0.254: 66.68,41.25 66.68,40.74 67.69,39.73 70.61,39.73 71.12,40.23 71.12,44.81 71.88,45.57 U4.7
$1N1052: length 39.7
  Top Layer w0.254: v1(43.05,29.39) 40.51,26.84 U18.9 ; 69.22,41.25 69.22,41.58 65.91,44.88 v1(65.66,44.88) 65.66,46.03 U4.2
  Bottom Layer w0.254: v1(43.05,29.39) 58.55,44.88 v1(65.66,44.88)
$1N1059: length 5
  Top Layer w0.254: 70.49,41.25 70.49,46.03 U4.6
$1N1738: length 6.7
  Top Layer w0.254: U4.13 67.89,51.81 67.89,52.54 65.09,55.33 RN2.1
$1N1744: length 6.9
  Top Layer w0.254: RN2.2 65.89,55.33 69.34,51.89 U4.12
$1N1751: length 7.1
  Top Layer w0.254: RN2.3 66.69,56.6 70.5,52.79 70.5,51.74 U4.11
$1N1758: length 7.3
  Top Layer w0.254: U4.10 71.88,52.72 RN2.4
$1N1765: length 6.9
  Top Layer w0.254: RN3.1 69.67,55.59 72.97,52.29 72.97,51.81 U4.9
$1N1772: length 13.3
  Top Layer w0.254: RN3.2 70.47,57.62 70.21,57.87 64.62,57.87 64.37,57.62 64.37,54.06 65.53,52.9 U4.15
$1N1781: length 15.5
  Top Layer w0.254: U4.14 66.8,51.16 67.71,50.25 73.3,50.25 73.81,50.76 73.81,53.3 71.27,55.84 RN3.3
$1N2117: length 20.4
  Top Layer w0.254: LED2.10 66.29,69.6 66.29,65.53 65.09,64.33 RN2.8
$1N2128: length 17.5
  Top Layer w0.254: RN2.7 65.89,64.37 66.8,65.28 66.8,67.56 LED2.9
$1N2138: length 12.1
  Top Layer w0.254: LED2.7 66.69,62.38 RN2.6
$1N2150: length 8.1
  Top Layer w0.254: v1(67.49,62.3) RN2.5
  Bottom Layer w0.254: LED2.5 65.02,64.77 v1(67.49,62.3)
$1N2410: length 11.5
  Top Layer w0.254: RN3.8 69.34,59.04 v1(69.34,64.01)
  Bottom Layer w0.254: LED2.4 v1(69.34,64.01)
$1N2417: length 29.9
  Top Layer w0.254: RN3.7 70.47,65.17 72.24,66.95 72.75,66.95 73.77,67.96 73.77,76.35 73.01,77.11 68.73,77.11 LED2.2
$1N2425: length 31.8
  Top Layer w0.254: LED2.1 66.8,77.72 73.04,77.72 74.31,76.45 74.31,59.69 72.54,57.91 71.52,57.91 71.27,58.17 RN3.6
$1N2437: length 7.3
  Top Layer w0.254: RN3.5 72.64,59.29 LED2.6
$1N2889: length 6.5
  Top Layer w0.254: U6.1 76.33,45.57 80.14,41.76 80.14,41.25
$1N2894: length 11.7
  Top Layer w0.254: U6.7 83.36,45.57 83.36,40.23 82.85,39.73 80.05,39.73 78.87,40.91 78.87,41.25
$1N2912: length 6.5
  Top Layer w0.254: U6.2 77.6,45.57 81.41,41.76 81.41,41.25
$1N2917: length 4.9
  Top Layer w0.254: 82.68,41.25 U6.6
$1N2922: length 6.7
  Top Layer w0.254: RN4.1 77.16,56.35 79.95,53.56 79.95,51.81 U6.13
$1N2926: length 6.9
  Top Layer w0.254: 81.41,51.63 81.41,52.9 77.96,56.35 RN4.2
$1N2930: length 7.1
  Top Layer w0.254: U6.11 82.57,51.74 82.57,52.54 78.76,56.35 RN4.3
$1N2934: length 7.3
  Top Layer w0.254: RN4.4 83.95,52.72 U6.10
$1N2938: length 6.9
  Top Layer w0.254: RN5.1 81.86,55.59 85.16,52.29 85.16,51.69 U6.9
$1N2940: length 13.6
  Top Layer w0.254: RN5.2 82.66,57.62 82.4,57.87 76.56,57.87 76.31,57.62 76.31,54.06 77.6,52.78 U6.15
$1N2944: length 15.4
  Top Layer w0.254: RN5.3 83.46,55.97 85.87,53.56 85.87,50.76 85.36,50.25 79.78,50.25 78.87,51.16 U6.14
$1N2950: length 21.8
  Top Layer w0.254: RN4.8 75.63,60.24 75.63,66.11 76.4,66.87 76.91,66.87 78.1,68.07 78.1,69.6 LED3.10
$1N2955: length 8.2
  Top Layer w0.254: RN4.5 79.38,58.9 v1(79.38,63.25)
  Bottom Layer w0.254: LED3.5 v1(79.38,63.25)
$1N2958: length 12.7
  Top Layer w0.254: RN4.6 78.76,63.9 83.19,68.33 LED3.7
$1N2963: length 17.4
  Top Layer w0.254: LED3.9 77.96,66.91 RN4.7
$1N2968: length 11.7
  Top Layer w0.254: v1(81.15,64.01) 81.15,59.42 RN5.8
  Bottom Layer w0.254: LED3.4 v1(81.15,64.01)
$1N2973: length 29.9
  Top Layer w0.254: LED3.2 80.65,77.22 84.71,77.22 85.72,76.2 85.72,68.07 84.71,67.06 84.2,67.06 82.66,65.51 RN5.7
$1N2978: length 31.7
  Top Layer w0.254: RN5.6 83.46,58.15 83.66,57.95 84.67,57.95 86.23,59.51 86.23,76.45 84.96,77.72 78.61,77.72 LED3.1
$1N2983: length 7.2
  Top Layer w0.254: LED3.6 84.46,58.91 RN5.5
$1N3417: length 16.4
  Top Layer w0.254: U7.7 82.19,22.37 R1.1 96.01,22.37 R2.1
$1N3437: length 22.9
  Top Layer w0.254: 91.31,12.38 91.31,13.95 R1.2 82.19,16.24 U7.6 79.38,18.03 v1(78.61,18.8)
  Bottom Layer w0.254: U7.2 74.55,18.8 v1(78.61,18.8)
$1N3494: length 9
  Top Layer w0.254: 88.14,12.38 83.5,12.38 U7.5
$1N3520: length 44.4
  Bottom Layer w0.254: U7.3 71.02,19.79 29.08,19.79
$1N3527: length 57.3
  Top Layer w0.254: v1(59.31,17.53) 76.07,34.29 76.58,34.29 77.6,35.31 U5.2
  Bottom Layer w0.254: v1(59.31,17.53) 56.77,14.99 U3.2
$1N3641: length 31.6
  Top Layer w0.254: SW1.2 v1(54.36,14.09)
  Bottom Layer w0.254: v1(54.36,14.09) 32.98,14.09 U3.1
$1N3646: length 15.4
  Top Layer w0.254: U1.2 65.41,36.22 66.37,37.19 74.55,37.19 77.6,40.23 77.6,41.25
$1N4551: length 24
  Top Layer w0.254: v1(43.81,27.86) 44.32,27.35 U18.12 ; U10.1 38.1,43.74 v1(38.99,42.85) ; v1(41.78,40.05) U8.13
  Bottom Layer w0.254: v1(38.99,42.85) v1(41.78,40.05) 41.78,29.64 43.56,27.86 v1(43.81,27.86)
$1N4556: length 17
  Top Layer w0.254: U8.14 40.51,43.41 38.74,45.19 38.74,47.22 39.24,47.73 43.31,47.73 43.81,47.22 43.81,45.19 44.07,44.93 44.83,44.93 45.59,45.7 45.59,46.16 U10.7
$1N4574: length 24.2
  Top Layer w0.254: U10.2 39.5,46.16 39.5,45.7 43.05,42.14 U8.12 v1(43.05,40.05) ; U18.13 45.59,28.62 47.62,30.66 47.62,33.2 v1(46.61,34.21)
  Bottom Layer w0.254: v1(46.61,34.21) 46.61,36.5 v1(43.05,40.05)
$1N4579: length 9.5
  Top Layer w0.254: U10.6 44.58,46.41 44.58,46.67 45.59,47.68 45.85,47.68 46.35,47.18 46.35,45.4 44.32,43.37 U8.11
$1N4584: length 6.9
  Top Layer w0.254: RN6.1 38.98,56.39 40,55.37 40.51,55.37 41.78,54.1 41.78,51.89 U10.13
$1N4588: length 8.1
  Top Layer w0.254: RN6.2 39.78,56.64 v1(40.04,56.39) ; U10.12 42.58,52.36 v1(42.58,52.83)
  Bottom Layer w0.254: v1(40.04,56.39) 39.53,55.88 39.53,54.35 41.05,52.83 v1(42.58,52.83)
$1N4592: length 7
  Top Layer w0.254: U10.11 44.39,51.81 44.39,52.83 40.58,56.64 RN6.3
$1N4596: length 7.2
  Top Layer w0.254: RN6.4 45.72,52.81 U10.10
$1N4600: length 6.8
  Top Layer w0.254: RN7.1 43.5,56.86 46.81,53.56 46.81,51.94 U10.9
$1N4602: length 9.5
  Top Layer w0.254: RN7.2 44.3,57.62 44.05,57.87 43.03,57.87 42.53,57.37 v1(42.53,56.86) ; v1(40.24,54.57) 39.37,53.7 U10.15
  Bottom Layer w0.254: v1(42.53,56.86) v1(40.24,54.57)
$1N4606: length 15.3
  Top Layer w0.254: U10.14 40.64,51.29 41.55,50.38 47.14,50.38 47.64,50.89 47.64,53.43 45.1,55.97 RN7.3
$1N4612: length 27.7
  Top Layer w0.254: LED4.10 45.34,77.08 38.48,77.08 37.71,76.32 37.71,60.02 RN6.8
$1N4617: length 8.1
  Top Layer w0.254: RN6.5 41.38,63.26 LED4.5
$1N4620: length 14
  Top Layer w0.254: RN6.6 40.64,58.69 40.64,58.29 40.89,58.04 41.91,58.04 42.16,58.29 v1(42.16,64.01)
  Bottom Layer w0.254: LED4.7 v1(42.16,64.01)
$1N4625: length 35.9
  Top Layer w0.254: LED4.9 47.75,74.68 47.75,76.2 46.23,77.72 38.51,77.72 37.24,76.45 37.24,59.25 38.51,57.98 39.53,57.98 39.78,58.24 RN6.7
$1N4630: length 11.5
  Top Layer w0.254: RN7.8 43.5,63.68 LED4.4
$1N4635: length 16.9
  Top Layer w0.254: RN7.7 44.3,67.96 LED4.2
$1N4640: length 19.8
  Top Layer w0.254: LED4.1 45.1,69.7 RN7.6
$1N4645: length 7.3
  Top Layer w0.254: LED4.6 46.48,59.29 RN7.5
$1N4671: length 6.5
  Top Layer w0.254: U11.13 54.23,41.89 50.42,45.7 U12.1
$1N4676: length 8.6
  Top Layer w0.254: v1(57.45,45.19) 57.45,45.7 U12.7 ; U11.14 52.96,42.31 v1(52.62,42.65)
  Bottom Layer w0.254: v1(52.62,42.65) 54.91,42.65 v1(57.45,45.19)
$1N4694: length 6.5
  Top Layer w0.254: U12.2 51.69,45.7 55.5,41.89 U11.12
$1N4699: length 4.9
  Top Layer w0.254: U11.11 U12.6
$1N4704: length 6.8
  Top Layer w0.254: U12.13 54.04,51.94 54.04,53.3 50.74,56.6 RN8.1
$1N4708: length 7
  Top Layer w0.254: U12.12 55.5,52.65 51.54,56.6 RN8.2
$1N4712: length 7.2
  Top Layer w0.254: U12.11 56.77,52.18 52.34,56.6 RN8.3
$1N4716: length 7.4
  Top Layer w0.254: RN8.4 58.04,52.22 U12.10
$1N4720: length 6.9
  Top Layer w0.254: U12.9 59.12,51.94 59.12,53.3 55.57,56.86 55.57,57.11
$1N4722: length 13.6
  Top Layer w0.254: RN9.2 56.37,57.62 56.12,57.87 50.27,57.87 50.02,57.62 50.02,55.33 51.69,53.66 U12.15
$1N4726: length 15.4
  Top Layer w0.254: RN9.3 57.17,55.97 59.96,53.17 59.96,50.89 59.46,50.38 53.87,50.38 52.96,51.29 U12.14
$1N4732: length 21.7
  Top Layer w0.254: LED5.10 51.82,69.6 51.82,68.07 50.74,67 50.24,67 49.47,66.24 49.47,59.98 RN8.8
$1N4737: length 8.1
  Top Layer w0.254: RN8.5 53.09,58.77 v1(53.09,62.99)
  Bottom Layer w0.254: v1(53.09,62.99) 50.55,65.53 LED5.5
$1N4740: length 12.5
  Top Layer w0.254: RN8.6 52.34,63.27 57.4,68.33 LED5.7
$1N4745: length 17.4
  Top Layer w0.254: RN8.7 51.54,64.24 51.82,64.52 51.82,67.06 LED5.9
$1N4750: length 11.7
  Top Layer w0.254: v1(54.86,64.01) 54.86,59.42 55.57,58.71
  Bottom Layer w0.254: LED5.4 v1(54.86,64.01)
$1N4755: length 29.9
  Top Layer w0.254: LED5.2 54.36,77.22 58.42,77.22 59.44,76.2 59.44,68.07 58.42,67.06 57.91,67.06 56.37,65.51 RN9.7
$1N4760: length 31.7
  Top Layer w0.254: LED5.1 52.32,77.72 58.67,77.72 59.94,76.45 59.94,59.51 58.38,57.95 57.37,57.95 57.17,58.15 RN9.6
$1N4765: length 7.2
  Top Layer w0.254: LED5.6 58.17,58.91 RN9.5
$1N4784: length 49.1
  Top Layer w0.254: v1(51.69,34.29) U11.2
  Bottom Layer w0.254: U9.2 28.7,25.78 51.56,25.78 52.96,27.18 52.96,33.02 v1(51.69,34.29)
$1N4792: length 34.3
  Top Layer w0.254: U9.1 19.95,8.39 49.78,8.39 SW2.2
$1N4794: length 17
  Top Layer w0.254: v1(49.35,41.38) 49.35,41.89 50.37,42.9 50.62,42.9 51.69,41.84 U11.15 ; v1(45.34,39.9) 44.32,38.89 41.53,38.89 39.24,36.6 U8.2
  Bottom Layer w0.254: v1(49.35,41.38) 47.88,39.9 v1(45.34,39.9)
$1N5692: length 7.7
  Top Layer w0.254: v1(15.88,42.9) 15.62,42.9 14.61,41.89 U13.14 ; U15.7 19.18,45.65 v1(19.18,45.14)
  Bottom Layer w0.254: v1(15.88,42.9) 16.94,42.9 v1(19.18,45.14)
$1N5710: length 6.8
  Top Layer w0.254: 17.14,41.38 17.14,42.65 15.11,44.68 14.35,44.68 13.33,45.7 U15.2
$1N5715: length 4.8
  Top Layer w0.254: U13.11 U15.6
$1N5720: length 6.6
  Top Layer w0.254: U15.13 15.82,51.69 15.82,54.32 13.28,56.86 RN10.1
$1N5724: length 6.8
  Top Layer w0.254: 17.14,51.63 17.13,51.65 17.13,53.81 14.08,56.86 RN10.2
$1N5728: length 9.1
  Top Layer w0.254: RN10.3 14.88,57.62 15.13,57.87 16.15,57.87 16.91,57.11 16.91,56.6 18.43,55.08 18.43,51.65 U15.11
$1N5732: length 10.1
  Top Layer w0.254: U15.10 19.69,51.38 18.67,50.36 18.01,50.36 17.76,50.61 17.76,55.03 RN10.4
$1N5736: length 6.8
  Top Layer w0.254: U15.9 20.77,51.81 20.77,53.81 17.72,56.86 RN11.1
$1N5738: length 9.1
  Top Layer w0.254: U15.15 13.33,52.65 v1(14.97,54.28) ; RN11.2 v1(18.52,57.83)
  Bottom Layer w0.254: v1(18.52,57.83) v1(14.97,54.28)
$1N5742: length 15.8
  Top Layer w0.254: RN11.3 19.32,55.84 21.61,53.56 21.61,50.76 20.59,49.75 16.02,49.75 14.61,51.16 U15.14
$1N5748: length 22
  Top Layer w0.254: LED6.10 14.22,69.72 14.22,68.2 13.21,67.18 12.7,67.18 11.68,66.17 11.68,60.31 RN10.8
$1N5753: length 8.3
  Top Layer w0.254: RN10.5 15.49,58.9 v1(15.49,63.37)
  Bottom Layer w0.254: LED6.5 v1(15.49,63.37)
$1N5756: length 12.8
  Top Layer w0.254: LED6.7 19.3,68.45 14.88,64.03 RN10.6
$1N5761: length 17.5
  Top Layer w0.254: LED6.9 14.08,67.04 RN10.7
$1N5766: length 11.7
  Top Layer w0.254: RN11.8 17.27,59.16 v1(17.27,64.14)
  Bottom Layer w0.254: LED6.4 v1(17.27,64.14)
$1N5771: length 30.2
  Top Layer w0.254: LED6.2 16.76,77.34 20.83,77.34 21.84,76.33 21.84,68.2 20.83,67.18 20.32,67.18 18.52,65.39 RN11.7
$1N5776: length 31.8
  Top Layer w0.254: RN11.6 19.32,58.35 19.72,57.95 20.48,57.95 22.35,59.82 22.35,76.58 21.08,77.85 14.73,77.85 LED6.1
$1N5781: length 7.4
  Top Layer w0.254: LED6.6 20.57,59.16 RN11.5
$1N5807: length 6.5
  Top Layer w0.254: U17.1 24,45.7 27.81,41.89 U16.13
$1N5812: length 10.2
  Top Layer w0.254: U17.7 31.62,46.03 v1(29.51,43.92) ; U16.14 26.54,41.04 27.73,39.85 27.98,39.85 28.49,40.36 v1(28.49,42.9)
  Bottom Layer w0.254: v1(28.49,42.9) v1(29.51,43.92)
$1N5830: length 24.4
  Top Layer w0.254: v1(39.75,33.35) 40.51,33.35 41.78,32.08 U18.5 ; 25.27,46.29 25.36,46.2 25.36,45.95 26.37,44.93 27.31,44.93 29.08,43.16 U16.12 29.74,40.72 v1(29.74,40.21)
  Bottom Layer w0.254: v1(39.75,33.35) 32.89,40.21 v1(29.74,40.21)
$1N5835: length 9.4
  Top Layer w0.254: U17.6 30.44,46.37 30.44,46.62 31.45,47.64 31.79,47.64 32.21,47.22 32.21,45.19 30.35,43.33 U16.11
$1N5840: length 6.5
  Top Layer w0.254: RN12.1 24.96,56.86 27.81,54.01 U17.13
$1N5844: length 6.7
  Top Layer w0.254: RN12.2 25.76,56.86 29.06,53.56 29.06,51.78 U17.12
$1N5848: length 9.1
  Top Layer w0.254: RN12.3 26.56,57.62 26.82,57.87 27.83,57.87 28.85,56.86 28.85,56.6 v1(30.37,55.08) ; U17.11 30.37,51.78 v1(30.37,53.05)
  Bottom Layer w0.254: v1(30.37,55.08) v1(30.37,53.05)
$1N5852: length 7.1
  Top Layer w0.254: RN12.4 31.62,52.85 U17.10
$1N5856: length 6.7
  Top Layer w0.254: RN13.1 29.53,56.86 32.89,53.5 U17.9
$1N5858: length 8.9
  Top Layer w0.254: 25.27,51.76 25.27,52.77 v1(26.52,54.02) ; RN13.2 v1(30.33,57.83)
  Bottom Layer w0.254: v1(30.33,57.83) v1(26.52,54.02)
$1N5862: length 15.5
  Top Layer w0.254: RN13.3 31.13,55.84 33.67,53.3 33.67,51.02 32.91,50.25 27.58,50.25 26.56,51.27 26.56,51.74 U17.14
$1N5868: length 21.7
  Top Layer w0.254: LED7.10 26.29,69.72 26.29,68.2 25.22,67.13 24.71,67.13 23.95,66.36 23.95,59.73 RN12.8
$1N5873: length 8.2
  Top Layer w0.254: RN12.5 27.31,58.77 v1(27.31,62.87)
  Bottom Layer w0.254: LED7.5 25.02,65.15 v1(27.31,62.87)
$1N5876: length 12.7
  Top Layer w0.254: RN12.6 26.54,58.73 26.54,63.12 31.88,68.45 LED7.7
$1N5881: length 17.7
  Top Layer w0.254: LED7.9 26.29,67.18 26.29,64.64 25.76,64.12 RN12.7
$1N5886: length 11.6
  Top Layer w0.254: RN13.8 29.34,58.91 v1(29.34,64.14)
  Bottom Layer w0.254: LED7.4 v1(29.34,64.14)
$1N5891: length 30.3
  Top Layer w0.254: LED7.2 28.83,77.34 32.89,77.34 33.91,76.33 33.91,68.2 32.89,67.18 32.38,67.18 30.33,65.13 RN13.7
$1N5896: length 31.9
  Top Layer w0.254: LED7.1 26.8,77.85 33.15,77.85 34.42,76.58 34.42,60.07 32.3,57.95 31.53,57.95 31.13,58.35 RN13.6
$1N5901: length 7.5
  Top Layer w0.254: LED7.6 32.64,59.42 RN13.5
$1N5916: length 32.4
  Top Layer w0.254: v1(24.64,34.7) 24.64,35.2 25.27,35.84
  Bottom Layer w0.254: U14.2 5.59,16.76 5.59,20.22 20.07,34.7 v1(24.64,34.7)
$1N5924: length 40.1
  Top Layer w0.254: U14.1 14.44,17.26 SW3.2
$1N5926: length 15.7
  Top Layer w0.254: U13.2 13.33,36.35 15.62,38.63 v1(16.89,38.63) ; v1(24.77,42.44) 24.77,41.89 25.27,41.38
  Bottom Layer w0.254: v1(24.77,42.44) 20.7,42.44 v1(16.89,38.63)
$1N6192: length 26.4
  Top Layer w0.254: U8.1 37.72,35.59 v1(37.72,34.47) ; U19.11 54.23,25.97 53.21,24.95 44.07,24.95 43.05,25.97 U18.11 43.05,28.37 43.81,29.13 43.81,29.64 43.31,30.15 v1(41.02,30.15)
  Bottom Layer w0.254: v1(37.72,34.47) 41.02,31.16 v1(41.02,30.15)
$1N6278: length 32.1
  Top Layer w0.254: U1.1 56.77,28.35 U19.13 56.63,26.08 56.63,25.71 55.36,24.44 40.63,24.44 39.24,25.83 U18.8
$1N6512: length 42
  Top Layer w0.254: U19.12 55.5,26.56 54.06,28 50.5,28 49.49,26.98 v1(49.49,26.48)
  Bottom Layer w0.254: U9.3 24.34,26.22 49.24,26.22 v1(49.49,26.48)
$1N6532: length 49.5
  Top Layer w0.254: v1(52.28,27.41) 52.28,26.9 U19.10
  Bottom Layer w0.254: U14.3 14.22,26.64 48.77,26.64 49.53,27.41 v1(52.28,27.41)
$1N6571: length 32
  Top Layer w0.254: U13.1 12.06,35.39 17.4,30.05 39.5,30.05 40.51,31.07 U18.6
$1N6582: length 42.8
  Top Layer w0.254: U15.1 12.17,46.06 12.17,45.44 13.95,43.66 13.95,40.36 14.45,39.85 16.89,39.85 ; v1(22.58,41.38) 21.06,39.85 16.89,39.85 ; v1(40.26,34.12) 41.02,34.12 43.05,32.08 U18.4 ; 16.89,39.85 15.88,40.87 U13.13
  Bottom Layer w0.254: v1(22.58,41.38) 33,41.38 v1(40.26,34.12)

## Copper pours and planes (outline as drawn; the poured copper is in the pictures)
GND on Top Layer: 3.3,79.25 99.19,79.25 99.19,6.86 3.3,6.86
